# Altium schematic sheet RSxx.SchDoc
size A
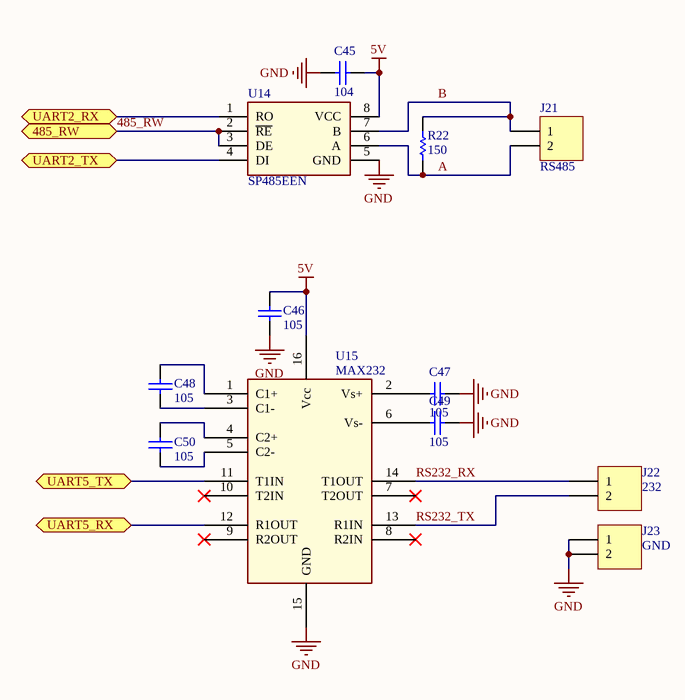
[diagram p0: RSxx.SchDoc]

## Parts
C45  104  [C0603]
C46  105  [C0603]
C47  105  [C0603]
C48  105  [C0603]
C49  105  [C0603]
C50  105  [C0603]
J21  RS485  [DOMINO NORMAL 2]
J22  232  [DOMINO NORMAL 2]
J23  GND  [DOMINO NORMAL 2]
R22  150  [R0603]
U14  SP485EEN  [SO8_L]
U15  MAX232  [SOIC16_M]

## Ports
485_RW, UART2_RX, UART2_TX, UART5_RX, UART5_TX

## Nets
5V: C45.2 C46.2 U14.8(VCC) U15.16(Vcc)
GND: C45.1 C46.1 C47.2 C49.2 J23.1 J23.2 U14.5(GND) U15.15(GND)
485_RW: U14.2(~{RE}) U14.3(DE) ; port 485_RW
A: J21.2 R22.1 U14.6(A)
B: J21.1 R22.2 U14.7(B)
RS232_RX: J22.1 U15.14(T1OUT)
RS232_TX: J22.2 U15.13(R1IN)
UART2_RX: U14.1(RO) ; port UART2_RX
UART2_TX: U14.4(DI) ; port UART2_TX
UART5_RX: U15.12(R1OUT) ; port UART5_RX
UART5_TX: U15.11(T1IN) ; port UART5_TX
NetC47_1: C47.1 U15.2(Vs+)
NetC48_1: C48.1 U15.3(C1-)
NetC48_2: C48.2 U15.1(C1+)
NetC49_1: C49.1 U15.6(Vs-)
NetC50_1: C50.1 U15.5(C2-)
NetC50_2: C50.2 U15.4(C2+)

Not connected (* = marked no-connect by the designer): U15 7(T2OUT)* 8(R2IN)* 9(R2OUT)* 10(T2IN)*

## Library data of the parts
C45-C50 = Cap_SMT: CAP CER 0.1UF 16V Y5V 0402; Manufacturer: Yageo; Manufacturer Part Number: CC0603ZRY5V7BB104; Published: 8-Jun-2000; LatestRevisionDate: 17-Jul-2002; LatestRevisionNote: Re-released for DXP Platform.; PackageReference: C0603; Publisher: Altium Limited; Digi-Key Part Number: 311-1047-1-ND; Unit Price: 0.00648
  C45: Value: 104
  C46-C50: Value: 105
J21-J23 = Header 2: Header, 2-Pin; LatestRevisionDate: 17-Jul-2002; LatestRevisionNote: Re-released for DXP Platform.; Publisher: Altium Limited
R22 = R_SMD5: Resistor SMD 5%; Manufacturer: Panasonic Electronic Components; Manufacturer Part Number: ERJ-2RKF3241X; Published: 8-Jun-2000; LatestRevisionDate: 17-Jul-2002; LatestRevisionNote: Re-released for DXP Platform.; PackageReference: R0603; Publisher: Altium Limited; Digi-Key Part Number: P3.24KLTR-ND; Unit Price: 0.00203; Value: 150